# EAGLE board FastDataAcq (EAGLE 6.5.0), part 1 of 3
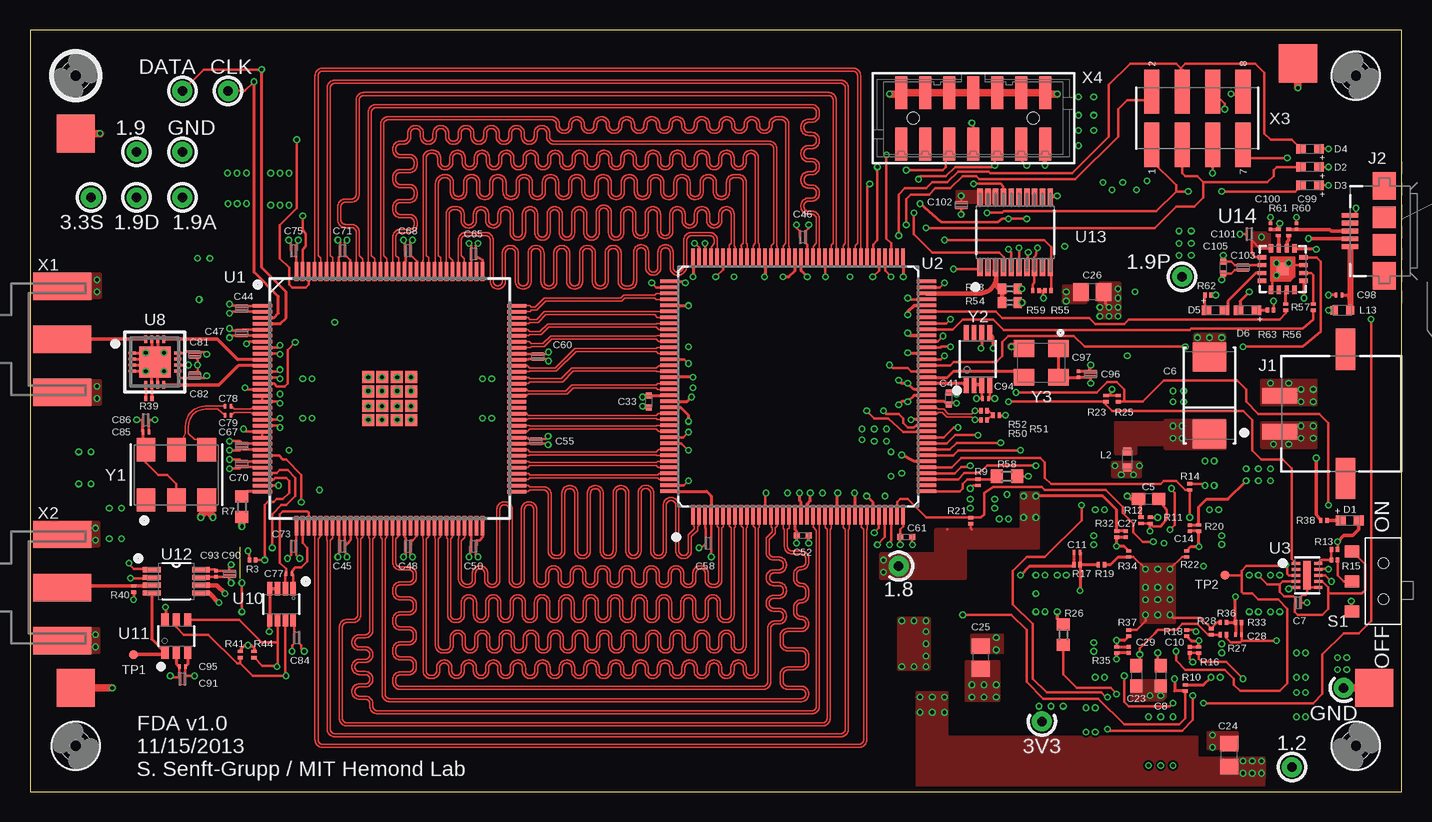
[diagram p3: board, top side]
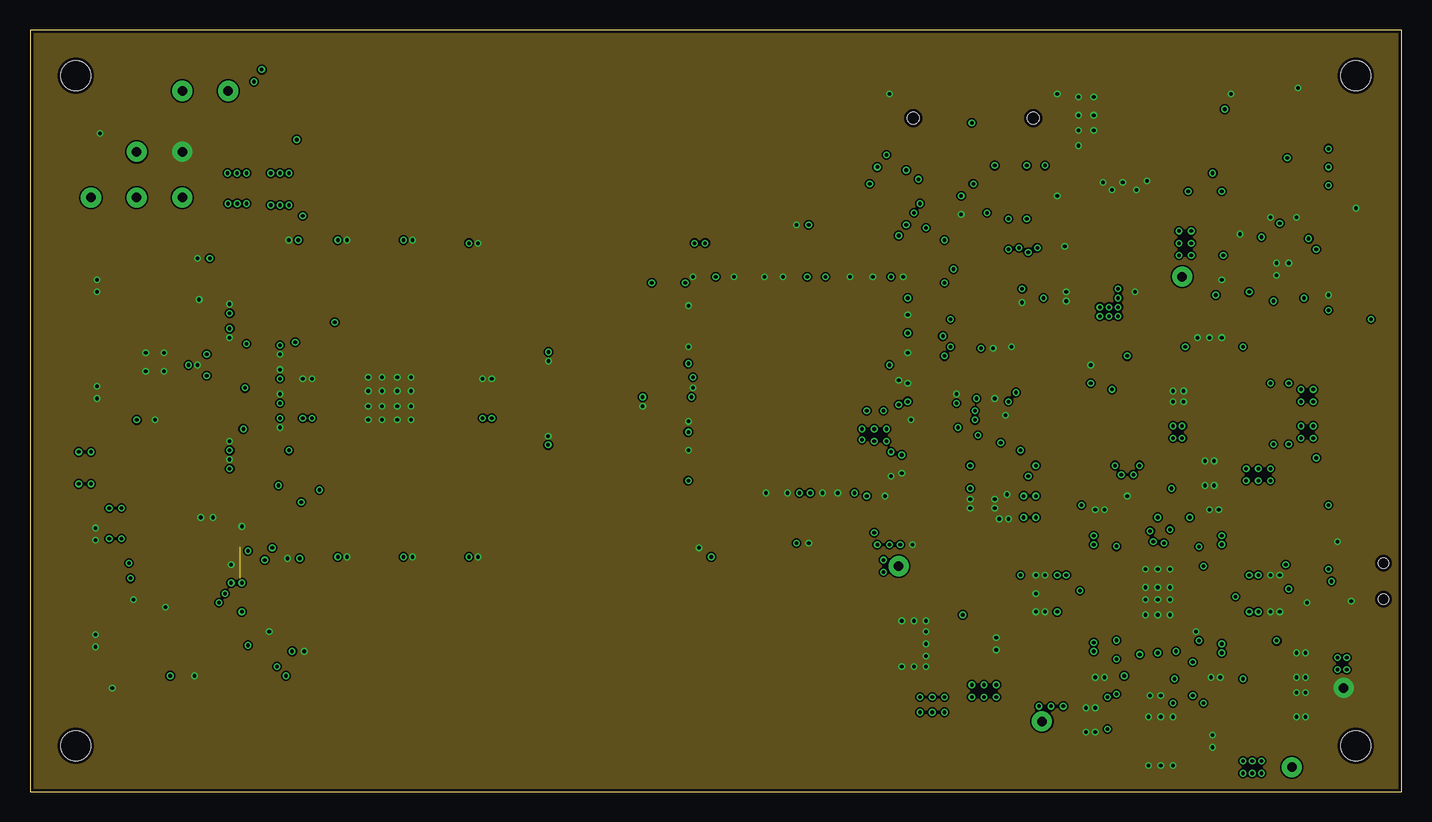
[diagram p4: board, inner layer GND]
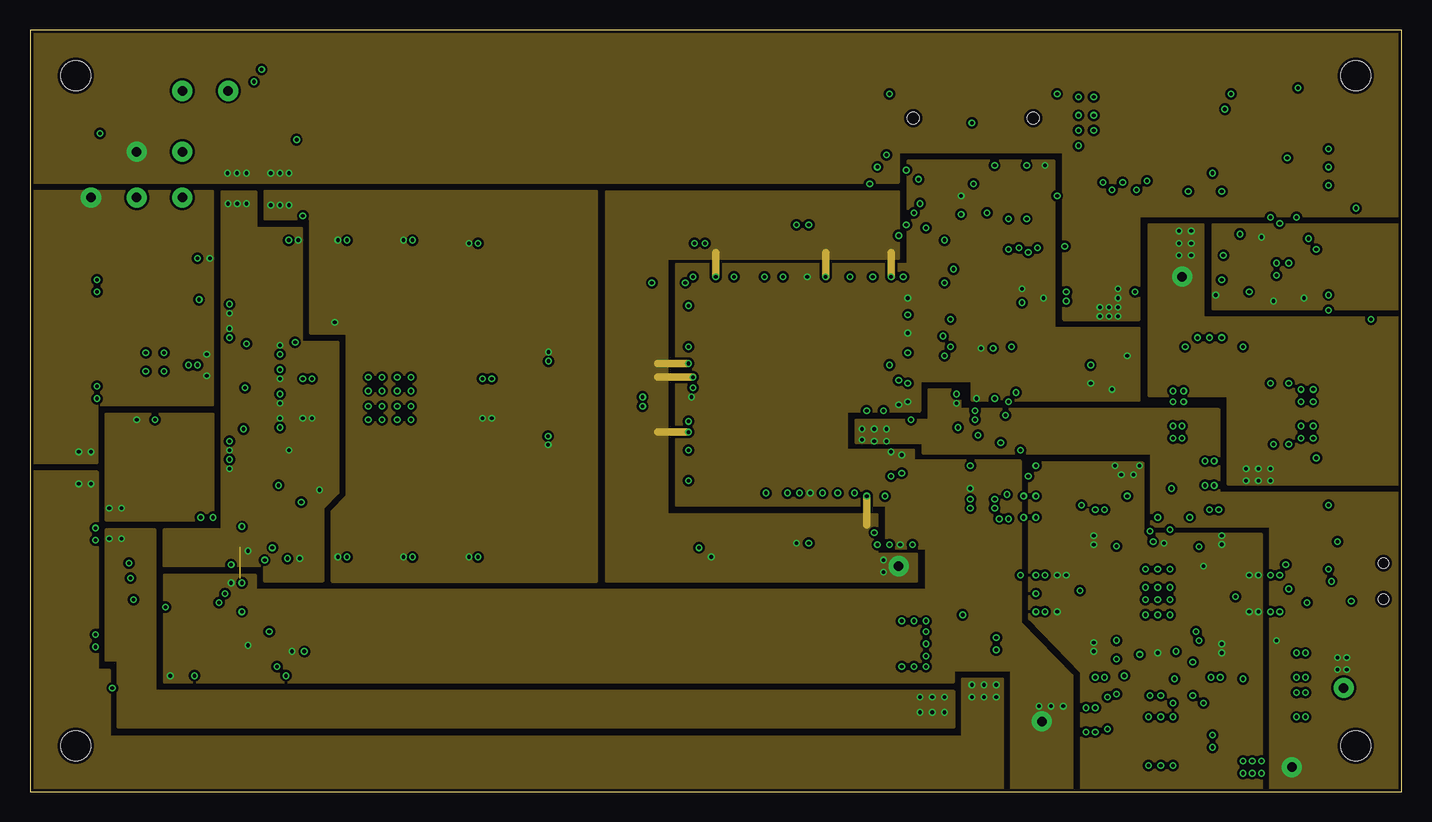
[diagram p5: board, inner layer Power]
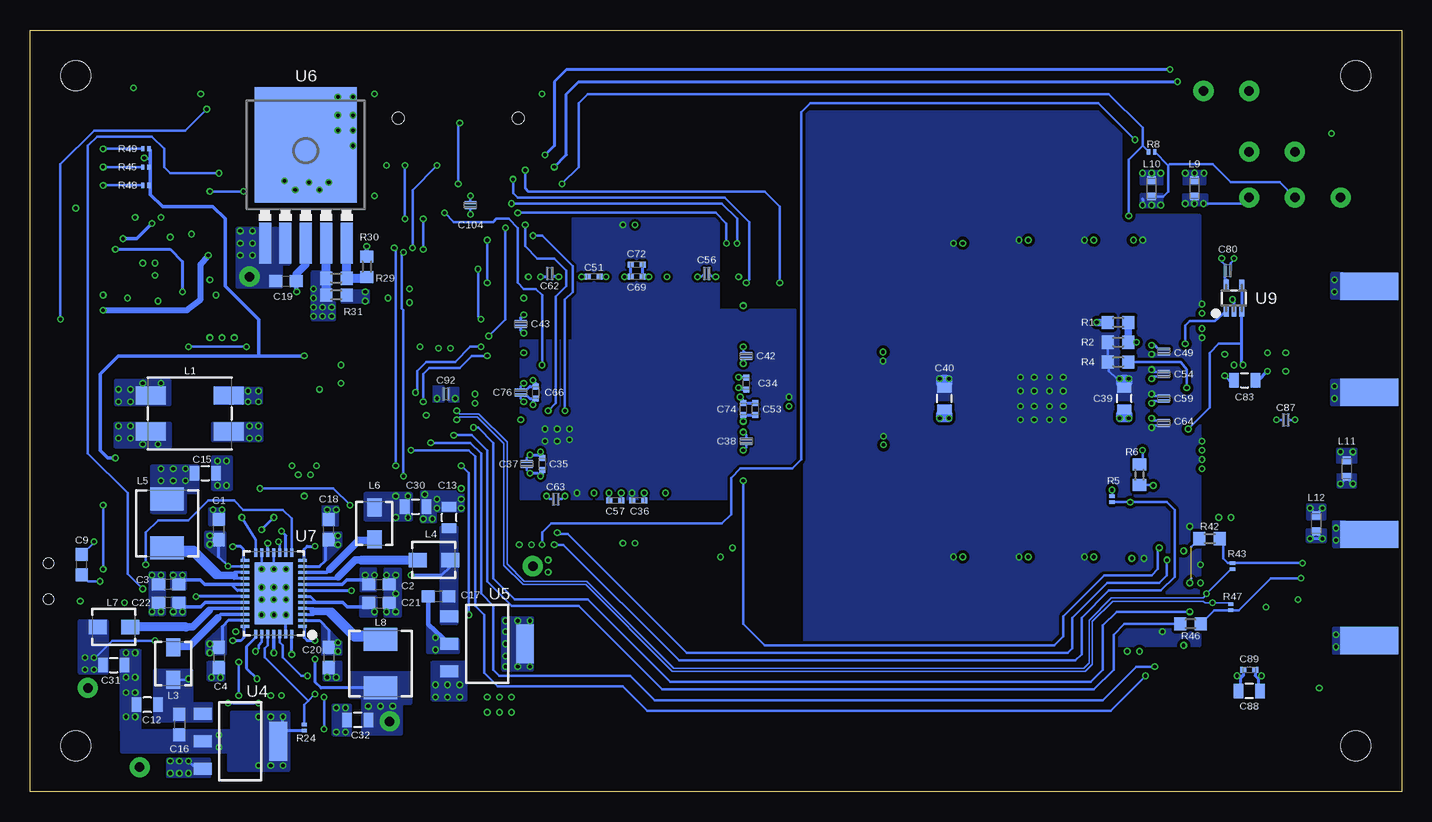
[diagram p6: board, bottom side, seen from below]

Size 114.3 x 63.5 mm. Coordinates in mm from the lower left corner, seen from the top.
Outline: 0,0 114.3,0 114.3,63.5 0,63.5 0,0
Copper layers (1+2*3+16): Top 0.035mm / dielectric 10mil / GND 0.035mm / dielectric 0.15mm / Power 0.035mm / dielectric 0.2mm / Bottom 0.035mm
Design rules "fda_design_rules *": minimum track width 5mil, minimum drill 12mil, track to track 5mil, track to pad 6mil, pad to pad 6mil, via to via 6mil, smd to smd 0mil, copper to edge 10mil, drill to drill 15mil, minimum pad ring 10mil, minimum via ring 5mil, stop-mask expansion 4mil, vias tented up to drill 0mil, thermal gap 10mil
Net classes: 1 50_Ohm: width 0.279 mm, clearance 0.127 mm; 2 Power: clearance 0.152 mm; 3 LVDS_5: width 0.127 mm, clearance 0.127 mm

## Footprints (pad centres in the part's own frame; a part is rotated, then mirrored left to right if it is on the bottom)
C0603 = smd 1.1 x 1: 1 -0.85,0; 2 0.85,0
2917_MURATA_CAP = smd 2.4 x 2.8: P$1 3.2,0; P$2 -3.2,0
0204REVERSE = smd 0.2 x 1: P$1 -0.2,0; P$2 0.2,0
C0201 = smd 0.25 x 0.35: 1 -0.25,0; 2 0.25,0
0805 = smd 0.8 x 1.2: 1 -0.9,0; 2 0.9,0
C0805 = smd 1.3 x 1.5: 1 -0.95,0; 2 0.95,0
0402_C = smd 0.5 x 0.5: P$1 0.5,0; P$2 -0.5,0
0603_LED = smd 0.8 x 0.8: ANODE 0.75,0; CATHODE -0.75,0
2.0 = hole 2.5: 0,0
MICRO-FIT_3.02POS_RA_SMD = smd 1.27 x 2.92: P$1 1.5,4.305; P$2 -1.5,4.305 | smd 3.43 x 1.65: P$3 5.385,-1.165; P$4 -5.385,-1.165
USB_MICROAB_SMT_1 = smd 0.4 x 1.4: D+ 0,4.3; D- -0.65,4.3; GND 1.3,4.3; ID 0.65,4.3; VCC -1.3,4.3 | smd 2.3 x 1.9: P$1 3.75,1.45; P$5 -3.75,1.45 | smd 1.8 x 1.9: P$2 1.15,1.45; P$4 -1.15,1.45
ACM7060_CHOKE = smd 2.5 x 1.5: P$1 -3.25,1.5; P$2 -3.25,-1.5; P$3 3.25,-1.5; P$4 3.25,1.5
MURATA_BLM18 = smd 0.65 x 0.7: P$1 0.675,0; P$2 -0.675,0
3.0X3.6_VISHAY = smd 1.5 x 1.2: P$1 -1.35,0; P$2 1.35,0
5.18X5.49_VISHAY = smd 1.915 x 2.79: P$1 -2.038,0; P$2 2.038,0
SMD1,27-2,54 = smd 3.175 x 3.175: 1 0,0
R0603 = smd 1 x 1.1: 1 -0.85,0; 2 0.85,0
R0201 = smd 0.28 x 0.43: 1 -0.255,0; 2 0.255,0
R0402 = smd 0.7 x 0.9: 1 -0.65,0; 2 0.65,0
AYZ0102AGRLC = smd 0.991 x 1.194: P$1 -2.489,2.616; P$2 0,2.616; P$3 2.489,2.616 | hole 0.864: -1.499,0; 1.499,0
PAD.03X.03 = smd 0.762 x 0.762: P$1 0,0
128HLQFP = smd 0.3 x 1.6: P$1 -7.75,-10.6; P$2 -7.25,-10.6; P$3 -6.75,-10.6; P$4 -6.25,-10.6; P$5 -5.75,-10.6; P$6 -5.25,-10.6; P$7 -4.75,-10.6; P$8 -4.25,-10.6; P$9 -3.75,-10.6; P$10 -3.25,-10.6; P$11 -2.75,-10.6; P$12 -2.25,-10.6; P$13 -1.75,-10.6; P$14 -1.25,-10.6; P$15 -0.75,-10.6; P$16 -0.25,-10.6; P$17 0.25,-10.6; P$18 0.75,-10.6; P$19 1.25,-10.6; P$20 1.75,-10.6; P$21 2.25,-10.6; P$22 2.75,-10.6; P$23 3.25,-10.6; P$24 3.75,-10.6; P$25 4.25,-10.6; P$26 4.75,-10.6; P$27 5.25,-10.6; P$28 5.75,-10.6; P$29 6.25,-10.6; P$30 6.75,-10.6; P$31 7.25,-10.6; P$32 7.75,-10.6; P$65 7.75,10.6; P$66 7.25,10.6; P$67 6.75,10.6; P$68 6.25,10.6; P$69 5.75,10.6; P$70 5.25,10.6; P$71 4.75,10.6; P$72 4.25,10.6; P$73 3.75,10.6; P$74 3.25,10.6; P$75 2.75,10.6; P$76 2.25,10.6; P$77 1.75,10.6; P$78 1.25,10.6; P$79 0.75,10.6; P$80 0.25,10.6; P$81 -0.25,10.6; P$82 -0.75,10.6; P$83 -1.25,10.6; P$84 -1.75,10.6; P$85 -2.25,10.6; P$86 -2.75,10.6; P$87 -3.25,10.6; P$88 -3.75,10.6; P$89 -4.25,10.6; P$90 -4.75,10.6; P$91 -5.25,10.6; P$92 -5.75,10.6; P$93 -6.25,10.6; P$94 -6.75,10.6; P$95 -7.25,10.6; P$96 -7.75,10.6 | smd 1.6 x 0.3: P$33 10.6,-7.75; P$34 10.6,-7.25; P$35 10.6,-6.75; P$36 10.6,-6.25; P$37 10.6,-5.75; P$38 10.6,-5.25; P$39 10.6,-4.75; P$40 10.6,-4.25; P$41 10.6,-3.75; P$42 10.6,-3.25; P$43 10.6,-2.75; P$44 10.6,-2.25; P$45 10.6,-1.75; P$46 10.6,-1.25; P$47 10.6,-0.75; P$48 10.6,-0.25; P$49 10.6,0.25; P$50 10.6,0.75; P$51 10.6,1.25; P$52 10.6,1.75; P$53 10.6,2.25; P$54 10.6,2.75; P$55 10.6,3.25; P$56 10.6,3.75; P$57 10.6,4.25; P$58 10.6,4.75; P$59 10.6,5.25; P$60 10.6,5.75; P$61 10.6,6.25; P$62 10.6,6.75; P$63 10.6,7.25; P$64 10.6,7.75; P$97 -10.6,7.75; P$98 -10.6,7.25; P$99 -10.6,6.75; P$100 -10.6,6.25; P$101 -10.6,5.75; P$102 -10.6,5.25; P$103 -10.6,4.75; P$104 -10.6,4.25; P$105 -10.6,3.75; P$106 -10.6,3.25; P$107 -10.6,2.75; P$108 -10.6,2.25; P$109 -10.6,1.75; P$110 -10.6,1.25; P$111 -10.6,0.75; P$112 -10.6,0.25; P$113 -10.6,-0.25; P$114 -10.6,-0.75; P$115 -10.6,-1.25; P$116 -10.6,-1.75; P$117 -10.6,-2.25; P$118 -10.6,-2.75; P$119 -10.6,-3.25; P$120 -10.6,-3.75; P$121 -10.6,-4.25; P$122 -10.6,-4.75; P$123 -10.6,-5.25; P$124 -10.6,-5.75; P$125 -10.6,-6.25; P$126 -10.6,-6.75; P$127 -10.6,-7.25; P$128 -10.6,-7.75 | smd 1 x 1: P$129 0.6,0.6; P$130 1.8,0.6; P$131 -0.6,0.6; P$132 -1.8,0.6; P$133 0.6,1.8; P$134 1.8,1.8; P$135 -0.6,1.8; P$136 -1.8,1.8; P$137 0.6,-1.8; P$138 1.8,-1.8; P$139 -0.6,-1.8; P$140 -1.8,-1.8; P$141 0.6,-0.6; P$142 1.8,-0.6; P$143 -0.6,-0.6; P$144 -1.8,-0.6
TQG144 = smd 0.3 x 1.6: P$1 -8.75,-10.7; P$2 -8.25,-10.7; P$3 -7.75,-10.7; P$4 -7.25,-10.7; P$5 -6.75,-10.7; P$6 -6.25,-10.7; P$7 -5.75,-10.7; P$8 -5.25,-10.7; P$9 -4.75,-10.7; P$10 -4.25,-10.7; P$11 -3.75,-10.7; P$12 -3.25,-10.7; P$13 -2.75,-10.7; P$14 -2.25,-10.7; P$15 -1.75,-10.7; P$16 -1.25,-10.7; P$17 -0.75,-10.7; P$18 -0.25,-10.7; P$19 0.25,-10.7; P$20 0.75,-10.7; P$21 1.25,-10.7; P$22 1.75,-10.7; P$23 2.25,-10.7; P$24 2.75,-10.7; P$25 3.25,-10.7; P$26 3.75,-10.7; P$27 4.25,-10.7; P$28 4.75,-10.7; P$29 5.25,-10.7; P$30 5.75,-10.7; P$31 6.25,-10.7; P$32 6.75,-10.7; P$33 7.25,-10.7; P$34 7.75,-10.7; P$35 8.25,-10.7; P$36 8.75,-10.7; P$73 8.75,10.7; P$74 8.25,10.7; P$75 7.75,10.7; P$76 7.25,10.7; P$77 6.75,10.7; P$78 6.25,10.7; P$79 5.75,10.7; P$80 5.25,10.7; P$81 4.75,10.7; P$82 4.25,10.7; P$83 3.75,10.7; P$84 3.25,10.7; P$85 2.75,10.7; P$86 2.25,10.7; P$87 1.75,10.7; P$88 1.25,10.7; P$89 0.75,10.7; P$90 0.25,10.7; P$91 -0.25,10.7; P$92 -0.75,10.7; P$93 -1.25,10.7; P$94 -1.75,10.7; P$95 -2.25,10.7; P$96 -2.75,10.7; P$97 -3.25,10.7; P$98 -3.75,10.7; P$99 -4.25,10.7; P$100 -4.75,10.7; P$101 -5.25,10.7; P$102 -5.75,10.7; P$103 -6.25,10.7; P$104 -6.75,10.7; P$105 -7.25,10.7; P$106 -7.75,10.7; P$107 -8.25,10.7; P$108 -8.75,10.7 | smd 1.6 x 0.3: P$37 10.7,-8.75; P$38 10.7,-8.25; P$39 10.7,-7.75; P$40 10.7,-7.25; P$41 10.7,-6.75; P$42 10.7,-6.25; P$43 10.7,-5.75; P$44 10.7,-5.25; P$45 10.7,-4.75; P$46 10.7,-4.25; P$47 10.7,-3.75; P$48 10.7,-3.25; P$49 10.7,-2.75; P$50 10.7,-2.25; P$51 10.7,-1.75; P$52 10.7,-1.25; P$53 10.7,-0.75; P$54 10.7,-0.25; P$55 10.7,0.25; P$56 10.7,0.75; P$57 10.7,1.25; P$58 10.7,1.75; P$59 10.7,2.25; P$60 10.7,2.75; P$61 10.7,3.25; P$62 10.7,3.75; P$63 10.7,4.25; P$64 10.7,4.75; P$65 10.7,5.25; P$66 10.7,5.75; P$67 10.7,6.25; P$68 10.7,6.75; P$69 10.7,7.25; P$70 10.7,7.75; P$71 10.7,8.25; P$72 10.7,8.75; P$109 -10.7,8.75; P$110 -10.7,8.25; P$111 -10.7,7.75; P$112 -10.7,7.25; P$113 -10.7,6.75; P$114 -10.7,6.25; P$115 -10.7,5.75; P$116 -10.7,5.25; P$117 -10.7,4.75; P$118 -10.7,4.25; P$119 -10.7,3.75; P$120 -10.7,3.25; P$121 -10.7,2.75; P$122 -10.7,2.25; P$123 -10.7,1.75; P$124 -10.7,1.25; P$125 -10.7,0.75; P$126 -10.7,0.25; P$127 -10.7,-0.25; P$128 -10.7,-0.75; P$129 -10.7,-1.25; P$130 -10.7,-1.75; P$131 -10.7,-2.25; P$132 -10.7,-2.75; P$133 -10.7,-3.25; P$134 -10.7,-3.75; P$135 -10.7,-4.25; P$136 -10.7,-4.75; P$137 -10.7,-5.25; P$138 -10.7,-5.75; P$139 -10.7,-6.25; P$140 -10.7,-6.75; P$141 -10.7,-7.25; P$142 -10.7,-7.75; P$143 -10.7,-8.25; P$144 -10.7,-8.75
10-DFN = smd 0.25 x 0.7: P$1 -1,-0.925; P$2 -0.5,-0.925; P$3 0,-0.925; P$4 0.5,-0.925; P$5 1,-0.925; P$6 1,0.925; P$7 0.5,0.925; P$8 0,0.925; P$9 -0.5,0.925; P$10 -1,0.925 | smd 2.39 x 0.64: P$11 0,0
SOT223 = smd 0.991 x 1.499: 1 -2.299,-3.15; 2 0,-3.15; 3 2.299,-3.15 | smd 3.277 x 1.499: 4 0,3.15
Q5-DD = smd 1 x 3.4: 1 -3.4,-7.875; 2 -1.7,-7.875; 3 0,-7.875; 4 1.7,-7.875; 5 3.4,-7.875 | smd 8.5 x 9.6: 6 0,0.325
38-QFN_(5X7) = smd 0.25 x 0.7: P$1 -2.75,-2.4; P$2 -2.25,-2.4; P$3 -1.75,-2.4; P$4 -1.25,-2.4; P$5 -0.75,-2.4; P$6 -0.25,-2.4; P$7 0.25,-2.4; P$8 0.75,-2.4; P$9 1.25,-2.4; P$10 1.75,-2.4; P$11 2.25,-2.4; P$12 2.75,-2.4; P$20 2.75,2.4; P$21 2.25,2.4; P$22 1.75,2.4; P$23 1.25,2.4; P$24 0.75,2.4; P$25 0.25,2.4; P$26 -0.25,2.4; P$27 -0.75,2.4; P$28 -1.25,2.4; P$29 -1.75,2.4; P$30 -2.25,2.4; P$31 -2.75,2.4 | smd 0.7 x 0.25: P$13 3.4,-1.5; P$14 3.4,-1; P$15 3.4,-0.5; P$16 3.4,0; P$17 3.4,0.5; P$18 3.4,1; P$19 3.4,1.5; P$32 -3.4,1.5; P$33 -3.4,1; P$34 -3.4,0.5; P$35 -3.4,0; P$36 -3.4,-0.5; P$37 -3.4,-1; P$38 -3.4,-1.5 | smd 5.15 x 3.15: P$39 0,0
16WQFN = smd 0.25 x 0.6: P$1 0.75,1.9; P$2 0.25,1.9; P$3 -0.25,1.9; P$4 -0.75,1.9; P$9 -0.75,-1.9; P$10 -0.25,-1.9; P$11 0.25,-1.9; P$12 0.75,-1.9 | smd 0.6 x 0.25: P$5 -1.9,0.75; P$6 -1.9,0.25; P$7 -1.9,-0.25; P$8 -1.9,-0.75; P$13 1.9,-0.75; P$14 1.9,-0.25; P$15 1.9,0.25; P$16 1.9,0.75 | smd 2.6 x 2.6: P$17 0,0
SC-70 = smd 0.4 x 0.9: P$1 -0.65,-1.1; P$2 0,-1.1; P$3 0.65,-1.1; P$4 0.65,1.1; P$5 -0.65,1.1
SOT23-8 = smd 0.45 x 1.1: P$1 -0.975,-1.3; P$2 -0.325,-1.3; P$3 0.325,-1.3; P$4 0.975,-1.3; P$5 0.975,1.3; P$6 0.325,1.3; P$7 -0.325,1.3; P$8 -0.975,1.3
SOT23-6 = smd 0.6 x 1.1: P$1 -0.95,-1.35; P$2 0,-1.35; P$3 0.95,-1.35; P$4 0.95,1.35; P$5 0,1.35; P$6 -0.95,1.35
SOP65P490X110-8N = smd 1.499 x 0.432: 1 -2.057,0.975; 2 -2.057,0.325; 3 -2.057,-0.325; 4 -2.057,-0.975; 5 2.057,-0.975; 6 2.057,-0.325; 7 2.057,0.325; 8 2.057,0.975
TSSOP20_XILINX = smd 1.5 x 0.45: P$1 -2.9,2.925; P$2 -2.9,2.275; P$3 -2.9,1.625; P$4 -2.9,0.975; P$5 -2.9,0.325; P$6 -2.9,-0.325; P$7 -2.9,-0.975; P$8 -2.9,-1.625; P$9 -2.9,-2.275; P$10 -2.9,-2.925; P$11 2.9,-2.925; P$12 2.9,-2.275; P$13 2.9,-1.625; P$14 2.9,-0.975; P$15 2.9,-0.325; P$16 2.9,0.325; P$17 2.9,0.975; P$18 2.9,1.625; P$19 2.9,2.275; P$20 2.9,2.925
QFN16 = smd 0.7 x 0.35: 1 -1.725,0.975; 2 -1.725,0.325; 3 -1.725,-0.325; 4 -1.725,-0.975; 9 1.725,-0.975; 10 1.725,-0.325; 11 1.725,0.325; 12 1.725,0.975 | smd 0.35 x 0.7: 5 -0.975,-1.725; 6 -0.325,-1.725; 7 0.325,-1.725; 8 0.975,-1.725; 13 0.975,1.725; 14 0.325,1.725; 15 -0.325,1.725; 16 -0.975,1.725 | smd 1 x 1: TAB 0,0
J502-ND-142-0701-801/806 = smd 4.826 x 2.286: 1 2.692,0; G@1 2.692,4.42; G@2 2.692,-4.42 | smd 4.826 x 2.286 bottom: G@3 2.692,4.42; G@4 2.692,-4.42
HEADER_8P_2R_SMT = smd 1.27 x 3.683: P$1 -3.81,-2.223; P$2 -3.81,2.223; P$3 -1.27,-2.223; P$4 -1.27,2.223; P$5 1.27,-2.223; P$6 1.27,2.223; P$7 3.81,-2.223; P$8 3.81,2.223
87832-14 = smd 1 x 2.75: 1 -6,-2.15; 2 -6,2.15; 3 -4,-2.15; 4 -4,2.15; 5 -2,-2.15; 6 -2,2.15; 7 0,-2.15; 8 0,2.15; 9 2,-2.15; 10 2,2.15; 11 4,-2.15; 12 4,2.15; 13 6,-2.15; 14 6,2.15 | hole 1: -5,0; 5,0
SI530 = smd 1.95 x 1.55: P$1 -2.1,2.54; P$2 -2.1,0; P$3 -2.1,-2.54; P$4 2.1,-2.54; P$5 2.1,0; P$6 2.1,2.54
UMAX8 = smd 1.35 x 0.4: P$1 -2.15,0.975; P$2 -2.15,0.325; P$3 -2.15,-0.325; P$4 -2.15,-0.975; P$5 2.15,-0.975; P$6 2.15,-0.325; P$7 2.15,0.325; P$8 2.15,0.975
SI500S = smd 1.7 x 1.4: P$1 -1.45,-1.2; P$2 1.45,-1.2; P$3 1.45,1.2; P$4 -1.45,1.2

## Placement (x,y rotation side)
C1  10uF  [C0603]  98.55,21.84 90 bottom
C2  10uF  [C0603]  85.22,17.27 0 bottom
C3  10uF  [C0603]  102.74,17.27 180 bottom
C4  10uF  [C0603]  98.55,11.18 270 bottom
C5  DNP  [C0603]  93.22,24.38 180 top
C6  100uF  [2917_MURATA_CAP]  98.3,33.02 270 top
C7  .1uF  [0204REVERSE]  105.66,15.75 0 top
C8  10uF  [C0603]  94.23,9.65 270 top
C9  DNP  [C0603]  109.98,18.92 90 bottom
C10  10pF  [C0201]  96.65,11.81 90 top
C11  10pF  [C0201]  87.25,19.94 0 top
C12  33uF  [0805]  104.52,7.24 180 bottom
C13  33uF  [0805]  79.38,22.86 90 bottom
C14  10pF  [C0201]  96.65,21.97 270 top
C15  33uF  [0805]  99.69,26.54 0 bottom
C16  10uF  [C0603]  101.85,5.59 270 bottom
C17  10uF  [C0603]  80.26,16.26 180 bottom
C18  10uF  [C0603]  89.41,21.84 90 bottom
C19  10uF  [C0603]  92.96,42.55 0 bottom
C20  10uF  [C0603]  89.41,11.18 270 bottom
C21  10uF  [C0603]  85.22,15.75 0 bottom
C22  10uF  [C0603]  102.74,15.75 180 bottom
C23  DNP  [C0603]  92.2,9.65 270 top
C24  22uF 150mOhm ESR  [C0805]  99.95,3.05 90 top
C25  22uF 150mOhm ESR  [C0805]  79.25,11.18 90 top
C26  22uF 150mOhm ESR  [C0805]  88.52,41.66 180 top
C27  10pF  [C0201]  91.31,21.46 270 top
C28  10pF  [C0201]  100.71,13.08 180 top
C29  10pF  [C0201]  91.57,11.81 90 top
C30  33uF  [0805]  82.17,23.75 0 bottom
C31  33uF  [0805]  107.31,10.54 0 bottom
C32  33uF  [0805]  87,5.97 180 bottom
C33  4.7uF  [0402_C]  51.56,32.51 90 top
C34  4.7uF  [0402_C]  54.61,34.04 90 bottom
C35  4.7uF  [0402_C]  71.63,27.3 90 bottom
C36  4.7uF  [0402_C]  63.63,24.26 180 bottom
C37  0.47uF  [0204REVERSE]  72.9,27.3 270 bottom
C38  0.47uF  [0204REVERSE]  54.61,29.21 270 bottom
C39  33uF  [0805]  23.11,32.77 90 bottom
C40  33uF  [0805]  38.1,32.77 90 bottom
C41  4.7uF  [0402_C]  76.58,32.77 270 top
C42  0.47uF  [0204REVERSE]  54.61,36.32 90 bottom
C43  0.47uF  [0204REVERSE]  73.41,38.99 90 bottom
C44  .1uF  [0204REVERSE]  17.65,40.26 90 top
C45  .1uF  [0204REVERSE]  26.04,20.45 0 top
C46  0.47uF  [0204REVERSE]  64.39,46.23 180 top
C47  .1uF  [0204REVERSE]  17.65,38.23 90 top
C48  .1uF  [0204REVERSE]  31.5,20.45 0 top
C49  .1uF  [0204REVERSE]  19.81,36.7 90 bottom
C50  .1uF  [0204REVERSE]  36.96,20.45 0 top
C51  4.7uF  [0402_C]  67.31,42.93 0 bottom
C52  4.7uF  [0402_C]  64.39,21.34 180 top
C53  4.7uF  [0402_C]  53.85,31.88 90 bottom
C54  .1uF  [0204REVERSE]  19.81,34.8 90 bottom
C55  .1uF  [0204REVERSE]  42.16,29.21 90 top
C56  0.47uF  [0204REVERSE]  57.91,43.18 180 bottom
C57  4.7uF  [0402_C]  65.53,24.26 0 bottom
C58  0.47uF  [0204REVERSE]  56.52,20.7 180 top
C59  .1uF  [0204REVERSE]  19.81,32.77 90 bottom
C60  .1uF  [0204REVERSE]  42.32,36.27 270 top
C61  4.7uF  [0402_C]  73.03,21.21 180 top
C62  0.47uF  [0204REVERSE]  70.99,43.18 0 bottom
C63  0.47uF  [0204REVERSE]  70.48,24.38 180 bottom
C64  .1uF  [0204REVERSE]  19.81,30.73 90 bottom
C65  .1uF  [0204REVERSE]  36.96,44.83 0 top
C66  4.7uF  [0402_C]  72.14,33.27 270 bottom
C67  .1uF  [0204REVERSE]  17.65,28.83 90 top
C68  .1uF  [0204REVERSE]  31.5,45.09 0 top
C69  4.7uF  [0402_C]  63.75,42.93 180 bottom
C70  .1uF  [0204REVERSE]  17.65,27.3 90 top
C71  .1uF  [0204REVERSE]  26.04,45.09 0 top
C72  4.7uF  [0402_C]  63.75,43.94 180 bottom
C73  .1uF  [0204REVERSE]  21.97,20.45 0 top
C74  4.7uF  [0402_C]  54.86,31.88 90 bottom
C75  .1uF  [0204REVERSE]  21.97,45.09 180 top
C76  0.47uF  [0204REVERSE]  73.41,33.27 90 bottom
C77  100pF  [C0201]  21.59,18.16 180 top
C78  4.7nF  [C0201]  16.51,32.13 0 top
C79  4.7nF  [C0201]  16.51,31.37 0 top
C80  .1uF  [0204REVERSE]  14.48,43.43 0 bottom
C81  .1uF  [0204REVERSE]  13.72,36.45 270 top
C82  .1uF  [0204REVERSE]  13.72,34.67 90 top
C83  33uF  [0805]  13.08,34.29 0 bottom
C84  .1uF  [0204REVERSE]  22.23,12.83 0 top
C85  10nF  [C0201]  9.65,29.97 0 top
C86  .1uF  [0204REVERSE]  9.65,30.99 0 top
C87  1uF  [0204REVERSE]  9.65,30.99 180 bottom
C88  33uF  [0805]  12.7,8.38 180 bottom
C89  4.7uF  [0402_C]  12.7,10.16 0 bottom
C90  1uF  [0204REVERSE]  16.64,18.16 90 top
C91  .1uF  [0204REVERSE]  12.7,9.4 0 top
C92  .1uF  [0204REVERSE]  79.63,33.15 180 bottom
C93  10nF  [C0201]  15.49,18.16 90 top
C94  10nF  [C0201]  79.63,32.77 0 top
C95  10nF  [C0201]  12.7,10.41 0 top
C96  .1uF  [0204REVERSE]  88.39,34.8 90 top
C97  10nF  [C0201]  87.38,34.8 90 top
C98  10nF  [C0201]  109.09,41.4 180 top
C99  47pF  [C0201]  105.54,47.12 270 top
C100  47pF  [C0201]  103.38,47.12 270 top
C101  .1uF  [0204REVERSE]  101.6,46.48 0 top
C102  .1uF  [0204REVERSE]  77.6,48.9 270 top
C103  .1uF  [0204REVERSE]  101.09,43.69 90 top
C104  1uF  [0204REVERSE]  77.6,48.9 270 bottom
C105  4.7uF  [0402_C]  99.44,43.69 270 top
D1  LED_0603_RED  [0603_LED]  109.98,22.61 180 top
D2  LED_0603_BLUE  [0603_LED]  106.68,52.07 0 top
D3  LED_0603_GREEN  [0603_LED]  106.68,50.55 0 top
D4  LED_0603_RED  [0603_LED]  106.68,53.59 0 top
D5  LED_0603_GREEN  [0603_LED]  98.81,40.13 180 top
D6  LED_0603_BLUE  [0603_LED]  101.47,40.13 0 top
H1  MOUNT-HOLE2.0  [2.0]  110.49,3.81 0 top
H2  MOUNT-HOLE2.0  [2.0]  110.49,59.69 90 top
H3  MOUNT-HOLE2.0  [2.0]  3.81,3.81 90 top
H4  MOUNT-HOLE2.0  [2.0]  3.81,59.69 0 top
J1  MICRO-FIT_3.0_2POS_RA_SMD  [MICRO-FIT_3.02POS_RA_SMD]  108.46,31.5 90 top
J2  USB_MICROAB_SMT  [USB_MICROAB_SMT_1]  114.3,46.74 90 top
L1  CHOKE_CM_ACM7060-301  [ACM7060_CHOKE]  100.97,31.53 0 bottom
L2  26  [MURATA_BLM18]  91.44,27.69 90 top
L3  2.2uH  [3.0X3.6_VISHAY]  102.36,10.67 270 bottom
L4  2.2uH  [3.0X3.6_VISHAY]  80.64,19.3 0 bottom
L5  2.2uH  [5.18X5.49_VISHAY]  102.87,22.35 90 bottom
L6  2.2uH  [3.0X3.6_VISHAY]  85.6,22.35 90 bottom
L7  2.2uH  [3.0X3.6_VISHAY]  107.31,13.72 180 bottom
L8  2.2uH  [5.18X5.49_VISHAY]  85.09,10.67 270 bottom
L9  26  [MURATA_BLM18]  17.27,50.29 90 bottom
L10  26  [MURATA_BLM18]  20.83,50.29 90 bottom
L11  26  [MURATA_BLM18]  4.57,26.92 90 bottom
L12  26  [MURATA_BLM18]  7.11,22.35 90 bottom
L13  330  [MURATA_BLM18]  109.35,40.13 0 top
PAD1  [SMD1,27-2,54]  3.81,8.64 90 top
PAD2  [SMD1,27-2,54]  112.01,8.64 0 top
PAD3  [SMD1,27-2,54]  3.81,54.86 0 top
PAD4  [SMD1,27-2,54]  105.66,60.71 0 top
R1  DNP  [R0603]  23.62,39.12 180 bottom
R2  DNP  [R0603]  23.62,37.47 0 bottom
R3  10k  [R0201]  18.54,19.3 0 top
R4  DNP  [R0603]  23.62,35.81 0 bottom
R5  10k  [R0201]  24.13,24.38 270 bottom
R6  DNP  [R0603]  21.84,26.42 90 bottom
R7  3.3k 0.1%  [R0603]  17.65,23.75 90 top
R8  10k  [R0201]  20.83,53.34 0 bottom
R9  4.7k  [R0201]  78.99,25.78 270 top
R10  523K  [R0201]  96.27,8.64 270 top
R11  649K  [R0201]  93.34,22.61 270 top
R12  150K  [R0201]  92.58,22.61 90 top
R13  523K  [R0201]  108.71,19.3 0 top
R14  523K  [R0201]  96.65,25.4 270 top
R15  113k  [R0201]  108.71,20.19 180 top
R16  523K  [R0201]  97.41,11.81 270 top
R17  523K  [R0201]  87.25,18.92 180 top
R18  210K  [R0201]  96.39,13.21 270 top
R19  150K  [R0201]  89.28,18.92 180 top
R20  523K  [R0201]  97.41,21.97 90 top
R21  10k  [R0201]  78.39,22.59 270 top
R22  280K  [R0201]  96.39,19.81 90 top
R23  523K  [R0201]  89.66,32.77 90 top
R24  523K  [R0201]  91.44,5.33 90 bottom
R25  523K  [R0201]  90.68,32.77 90 top
R26  DNP  [R0603]  86.11,13.08 270 top
R27  270k  [R0201]  99.44,13.08 180 top
R28  210K  [R0201]  98.42,13.34 270 top
R29  1.15k 1%  [R0603]  88.77,42.8 180 bottom
R30  2k 1%  [R0603]  86.23,43.76 270 bottom
R31  100  [R0603]  88.77,41.4 180 bottom
R32  806K  [R0201]  90.55,21.46 90 top
R33  210K  [R0201]  100.71,14.1 0 top
R34  649K  [R0201]  91.57,19.81 90 top
R35  845k  [R0201]  90.55,11.81 270 top
R36  422K  [R0201]  99.44,14.1 0 top
R37  270k  [R0201]  91.57,13.21 270 top
R38  330  [R0201]  107.82,22.61 0 top
R39  50  [R0201]  9.91,32.77 180 top
R40  50  [R0201]  8.64,16.89 90 top
R41  10k  [R0201]  17.53,11.43 90 top
R42  26.1k  [R0603]  16,21.08 0 bottom
R43  10k  [R0201]  14.1,18.8 270 bottom
R44  10k  [R0201]  18.67,11.43 90 top
R45  330  [R0201]  104.65,52.07 180 bottom
R46  16k  [R0603]  17.59,13.99 0 bottom
R47  10k  [R0201]  14.22,15.37 90 bottom
R48  330  [R0201]  104.65,50.55 180 bottom
R49  330  [R0201]  104.65,53.59 180 bottom
R50  50  [R0201]  79.5,30.99 180 top
R51  50  [R0201]  80.52,31.37 180 top
R52  50  [R0201]  79.5,31.75 180 top
R53  100 0.1%  [R0402]  81.66,41.91 0 top
R54  100 0.1%  [R0402]  81.66,40.77 180 top
R55  330  [R0201]  84.84,41.78 180 top
R56  330  [R0201]  104.65,40.39 270 top
R57  330  [R0201]  106.93,40.39 270 top
R58  0  [R0603]  81.41,26.29 180 top
R59  4.7k  [R0201]  83.82,41.78 0 top
R60  27  [R0201]  104.9,46.61 270 top
R61  27  [R0201]  104.01,46.61 270 top
R62  330  [R0201]  98.17,41.4 180 top
R63  330  [R0201]  103.38,40.13 180 top
S1  SLIDER_SPDT_AYZ0102AGRLC  [AYZ0102AGRLC]  112.78,17.53 90 top
TP1  TEST-POINT3  [PAD.03X.03]  8.64,11.43 0 top
TP2  TEST-POINT3  [PAD.03X.03]  99.57,18.03 0 top
U1  ADC08D500  [128HLQFP]  29.97,32.77 270 top
U2  XC6SLX9-3TQG144C  [TQG144]  64.01,33.78 0 top
U3  LTC2955-1  [10-DFN]  106.43,18.03 270 top
U4  LT1963AEST-2.5  [SOT223]  96.77,4.19 270 bottom
U5  LT1963AEST-3.3  [SOT223]  76.2,12.32 270 bottom
U6  LT1963AEQ  [Q5-DD]  91.31,53.59 0 bottom
U7  LTC3374QFN  [38-QFN_(5X7)]  93.98,16.51 90 bottom
U8  LMH6555  [16WQFN]  10.41,35.81 90 top
U9  LMV321SC-70  [SC-70]  13.97,41.15 0 bottom
U10  TMP421  [SOT23-8]  20.95,15.62 180 top
U11  DAC101C081  [SOT23-6]  12.19,12.95 0 top
U12  ADCMP553BRMZ  [SOP65P490X110-8N]  12.19,17.53 0 top
U13  XCFXXS04  [TSSOP20_XILINX]  82.1,46.63 90 top
U14  FT230XQ  [QFN16]  104.39,43.56 180 top
X1  SMA-142-0701-801/806  [J502-ND-142-0701-801/806]  0,37.72 0 top
X2  SMA-142-0701-801/806  [J502-ND-142-0701-801/806]  0,17.02 0 top
X3  HEADER_0.1"_8P_2R_SMT  [HEADER_8P_2R_SMT]  97.28,56.13 0 top
X4  87832-14  [87832-14]  78.61,56.13 180 top
Y1  SI530-500  [SI530]  12.19,26.42 90 top
Y2  100MHz  [UMAX8]  78.99,36.07 90 top
Y3  DNP  [SI500S]  84.27,35.74 180 top

## Tracks (layer width: path | path; a pad name or v marks a point on that pad's centre or on a via)
1V2  (via drill 0.3, 0.79 pad 1.68)
  Top 0.203: R27.1 99.7,12.83 100.08,12.45 100.84,12.45 100.97,12.57 | 100.97,12.57 C28.1 | v64.9,47.24 64.9,46.99 64.64,46.74 64.64,46.28 C46.P$1 64.64,46.17 64.64,45.72 64.76,45.6 U2.P$89 | v103.89,12.57 100.97,12.57
  Top 0.254: C28.1 R33.2 | U2.P$128 53.29,33.01 C33.P$1 51.44,32.89 v51.05,32.89 | U2.P$19 64.26,24.13 C36.P$1 64.13,24.88 v64.14,24.89 | U2.P$28 68.76,24.84 v68.71,24.89 | v77.22,32.38 76.7,32.38 C41.P$1 76.45,32.27 76.2,32.51 74.73,32.51 U2.P$52
  Bottom 0.203: v108.97,11.18 108.84,11.18 107.44,12.57 v103.89,12.57
  other vias: 109.73,11.18 108.97,10.16 109.73,10.16 71.37,29.21 71.37,30.23 69.34,30.23 69.34,29.34 70.36,30.23 70.36,29.21 105.16,2.03
  pour Bottom (isolate 0.203, no thermals): 56.9,47.75 56.9,40.13 50.55,40.13 50.55,24.38 73.41,24.38 73.41,37.59 69.09,37.59 69.09,47.75
  pour Bottom (no thermals): 107.82,9.91 107.82,14.22 110.24,14.22 110.24,9.91
  pour Power (isolate 0.203, no thermals): 114.05,0.25 103.38,0.25 103.38,22.1 93.47,22.1 93.47,28.19 74.42,28.19 74.42,29.08 68.83,29.08 68.83,30.99 74.93,30.99 74.93,33.53 77.47,33.53 77.47,31.88 99.06,31.88 99.06,24.89 114.05,24.89
1V8  (via drill 0.3, 0.79 pad 1.68)
  Top 0.203: U2.P$76 71.26,43.42 v71.75,42.93 | U2.P$103 57.76,43.53 v57.15,42.93 | U2.P$122 54.52,36.03 v54.86,35.69 | U2.P$135 54.42,29.53 v54.86,29.97 | U2.P$86 66.26,42.96 v66.29,42.93 | v56.77,19.56 56.77,20.65 C58.P$1 56.76,20.74 56.76,22.35 U2.P$4 | 76.44,21.86 76.45,21.84 | R21.2 78.39,21.94 78.49,21.84
  Top 0.254: C27.1 R32.2 90.55,23.5 89.41,24.64 v83.82,24.64 | v55.24,34.54 53.32,34.54 U2.P$125 | U2.P$31 70.26,24.1 v69.72,24.64 | U2.P$18 63.75,21.84 63.89,21.71 C52.P$1 63.88,21.33 v63.88,20.7 | U2.P$144 56.38,25.03 56.77,24.64 56.77,22.36 56.76,22.35
  Power 0.635: v57.15,42.93 57.15,44.96 | v71.75,42.93 71.75,44.96 | v69.72,24.64 69.72,22.23 | v54.86,29.97 52.32,29.97 | v55.24,34.54 52.32,34.54 | v54.86,35.69 52.32,35.69 | v66.29,42.93 66.29,44.96
  Bottom 0.203: 71.25,42.93 71.19,42.98 C62.P$1 | v57.15,42.93 57.46,42.93 C56.P$1 | v54.86,35.69 54.86,35.87 C42.P$1 | C38.P$1 54.61,29.72 v54.86,29.97 | C51.P$1 v66.29,42.93 | C63.P$1 69.98,24.38 v69.72,24.64
  Bottom 0.254: v71.75,42.93 71.25,42.93 | C34.P$1 v55.24,34.54
  other vias: 82.8,24.64 82.8,22.86 83.82,22.86 71.12,19.3 71.12,18.29 72.39,18.8
  pour Power (isolate 0.203, no thermals): 72.39,44.45 72.39,50.04 48.01,50.04 48.01,17.53 73.91,17.53 73.91,19.81 70.61,19.81 70.61,23.11 53.09,23.11 53.09,44.45
  pour Bottom (no thermals): 82.55,24.89 82.55,22.61 86.36,22.61 86.36,24.89
  pour Top (no thermals): 75.44,21.84 75.44,19.81 70.87,19.81 70.87,17.78 77.98,17.78 77.98,20.32 84.07,20.32 84.07,24.89 82.55,24.89 82.55,21.84
1V9  (via drill 0.3, 0.79 pad 1.68)
  Top 0.254: C26.1 89.47,41.56 R31.2 89.62,40.68 v89.92,40.39
  Bottom 0.762: U6.4 89.62,45.71 R29.2 R31.2
  other vias: 90.68,41.91 90.68,41.15 89.15,40.39 90.68,40.39 89.15,39.62 89.92,39.62 90.68,39.62 20.83,51.56 20.07,51.56 21.59,51.56 17.25,51.56 18.03,51.56 16.46,51.56 8.89,53.34
  pour Power (isolate 0.203, no thermals): 0.25,63.25 0.25,50.8 72.39,50.8 72.39,53.34 86.11,53.34 86.11,39.37 92.46,39.37 92.46,48.01 114.05,48.01 114.05,63.25
  pour Bottom (no thermals): 88.9,39.37 88.9,40.77 89.28,40.77 89.28,43.31 90.81,43.31 90.81,39.37
  pour Top (no thermals): 89.15,42.42 90.81,42.42 90.81,39.5 89.15,39.5
  pour Bottom (no thermals): 19.94,50.67 19.94,51.69 21.72,51.69 21.72,50.67
  pour Bottom (no thermals): 16.38,50.67 16.38,51.69 18.16,51.69 18.16,50.67
1V9A  (via drill 0.3, 0.79 pad 1.68)
  Top 0.203: v16.64,38.61 16.82,38.43 C47.P$2 17.74,38.52 U1.P$5 | v16.64,39.88 16.76,39.88 16.89,40.01 17.6,40.01 C44.P$1 17.7,40.02 U1.P$2 | v22.35,45.97 22.35,45.85 22.23,45.72 22.23,45.14 C75.P$1 22.17,43.42 U1.P$128 | v22.48,19.43 22.17,19.74 C73.P$2 22.17,22.11 U1.P$33 | v16.64,28.45 17.47,28.45 C67.P$1 17.77,28.52 U1.P$25 | v16.64,26.92 17.47,26.92 C70.P$1 18.11,27.11 18.16,27.05 19.34,27.05 U1.P$28 | U1.P$13 20.73,34.52 v20.83,34.42 | v20.83,32.38 20.7,32.52 U1.P$17 U1.P$16 | U1.P$20 20.73,31.02 v20.83,31.11 | R3.1 18.29,19.94 v18.16,20.07 | U1.P$8 20.63,37.02 v20.83,37.21
  Bottom 0.203: R6.2 21.59,27.52 v21.59,28.45 | C54.P$1 20.65,34.6 v20.83,34.42 | C59.P$1 20.65,32.57 v20.83,32.38 | C64.P$2 20.65,30.93 v20.83,31.11 | v24.13,25.15 R5.1 | v20.83,37.21 20.57,37.21 20.32,36.96 19.87,36.96 C49.P$2 | v16.51,49.02 13.21,49.02 v12.7,49.53
  Bottom 0.61: C39.1 22.73,31.48 v22.73,31.11 v23.5,31.11 | v23.5,31.11 23.5,31.5 23.24,31.75 | v23.5,31.11 23.37,31.11 23.11,31.37
  other vias: 17.27,49.02 18.03,49.02
  pour Power (isolate 0.203, no thermals): 24.38,17.53 19.56,17.53 19.56,18.8 11.18,18.8 11.18,21.84 16,21.84 16,50.04 18.8,50.04 18.8,46.99 22.61,46.99 22.61,37.47 25.65,37.47 25.65,24.89 24.38,23.62
  pour Bottom (no thermals): 16.26,49.78 16.26,48.9 18.16,48.9 18.16,49.78
1V9D  (via drill 0.3, 0.79 pad 1.68)
  Top 0.203: v25.65,19.56 25.65,19.81 25.78,19.94 25.78,20.39 C45.P$1 25.78,20.45 25.78,22.11 U1.P$40 | v31.11,19.56 31.3,19.74 C48.P$1 31.3,21.16 31.24,21.21 31.24,22.15 U1.P$51 | v36.58,19.56 36.58,19.68 36.7,19.81 36.7,20.39 C50.P$1 36.76,21.28 36.7,21.34 36.7,22.15 U1.P$62 | U1.P$73 C55.P$1 43,29.01 v43.18,28.91 | v43.2,36.65 43.02,36.47 C60.P$1 40.62,36.47 arc-90 U1.P$88 | U1.P$99 36.76,43.4 C65.P$1 36.76,45.54 v36.58,45.72 | U1.P$110 31.24,43.39 31.24,44.2 31.3,44.25 C68.P$1 31.24,45.14 31.24,45.72 31.11,45.85 v31.11,45.97 | v25.65,45.97 25.84,45.79 C71.P$1 25.84,44.63 25.72,44.52 U1.P$121
  Bottom 0.203: L10.P$2 19.85,49.62 19.43,50.04 19.43,52.2 | 19.43,52.2 R8.2 | v8.89,49.53 10.16,50.8 14.22,50.8 15.75,52.32 19.3,52.32 19.43,52.2
  Bottom 0.254: 21.59,49.4 v21.59,48.9
  Bottom 0.61: R1.2 v25.4,39.12 | v37.72,31.11 37.72,31.5 38.09,31.87 | 38.09,31.87 C40.1 38.48,31.5 v38.48,31.11 v37.72,31.11 | v37.72,31.11 37.85,31.11 38.1,31.37 | C40.1 38.09,31.87
  other vias: 20.83,48.9 20.07,48.9
  pour Power (isolate 0.203, no thermals): 25.15,17.53 47.24,17.53 47.24,50.04 19.56,50.04 19.56,47.75 23.37,47.75 23.37,38.23 26.42,38.23 26.42,24.64 25.15,23.37
  pour Bottom (no thermals): 19.94,48.77 19.94,49.78 21.72,49.78 21.72,48.77
2V3_1V9PRE  (via drill 0.3, 0.79 pad 1.68)
  Top 0.254: v101.35,25.91 99.82,24.38 98.04,24.38 97.41,23.75 R20.2 C14.1
  other vias: 95.76,46.74 95.76,45.72 95.76,44.7 96.77,46.74 96.77,45.72 96.77,44.7 101.35,26.92 102.36,26.92 103.38,26.92 102.36,25.91 103.38,25.91 96.01,42.93
  pour Bottom (no thermals): 100.33,27.18 100.33,24.89 101.35,24.89 101.35,23.24 104.14,23.24 104.14,27.18
  pour Bottom (no thermals): 97.03,42.04 97.03,46.99 92.71,46.99 92.71,43.94 93.34,43.94 93.34,42.04
  pour Power (isolate 0.203, no thermals): 93.22,47.24 93.23,33.02 99.82,33.03 99.82,27.67 99.81,25.65 114.05,25.65 114.05,39.5 97.79,39.5 97.79,47.24
2V5  (via drill 0.3)
  Bottom 0.254: U4.3 99.92,2.07 C24.1 100.65,2.1 v101.09,2.54 | 7.11,21.59 v7.62,21.08 v6.6,21.08 7.11,21.59 | L12.P$2 7.11,21.59
  other vias: 101.85,2.54 102.62,2.54 101.09,1.52 101.85,1.52 102.62,1.52 74.17,7.87 75.18,7.87 76.2,7.87 76.2,6.6 75.18,6.6 74.17,6.6
  pour Top (no thermals): 99.31,2.67 102.87,2.67 102.87,1.14 99.31,1.14
  pour Top (no thermals): 102.87,0.51 73.91,0.51 73.91,8.26 76.45,8.26 76.45,4.57 97.28,4.57 97.28,2.79 102.87,2.79
  pour Power (isolate 0.203): 76.96,8.38 76.96,5.33 7.37,5.33 7.37,10.92 6.35,10.92 6.35,21.84 10.41,21.84 10.41,8.38
  pour Bottom (no thermals): 6.35,21.84 6.35,20.83 7.87,20.83 7.87,21.84
  pour Bottom (no thermals): 99.31,2.67 102.87,2.67 102.87,1.27 99.31,1.27
2V5A  (via drill 0.3)
  Top 0.203: 9.4,30.94 C87.P$1 v8.89,30.99 | 9.4,28.96 9.4,28.77 Y1.P$6 9.65,27.43 10.67,26.42 11.43,26.42 12.19,25.65 Y1.P$2
  Top 0.254: 9.4,30.94 C85.1 9.4,28.96
  Bottom 0.203: C87.P$1 v8.89,30.99
  Bottom 0.254: 7.11,23.11 v6.6,23.62 | L12.P$1 7.11,23.11 | 7.11,23.11 v7.62,23.62
  pour Power (isolate 0.203): 6.35,22.61 6.35,31.5 15.24,31.5 15.24,22.61
  pour Bottom (no thermals): 6.35,22.73 6.35,23.88 7.87,23.88 7.87,22.73
2V8_2V5PRE  (via drill 0.3)
  Top 0.203: v101.09,9.4 99.69,10.79 97.66,10.79 97.41,11.05 R16.2 C10.1 96.65,11.05 v96.9,10.79 | v95,21.84 95.38,22.23 95.38,24.89 95,25.27 v95.12,25.27 | v87.63,23.88 87.63,22.61 84.58,19.56 83.06,19.56 81.92,18.41 81.92,15.62 83.57,13.97 83.57,9.4 84.71,8.26 89.28,8.26 89.66,7.87 v89.79,7.87 | v89.79,5.21 89.92,5.08 96.01,5.08 96.9,5.97 v96.9,8
  Top 0.254: R11.1 v93.98,22.86
  Bottom 0.203: L3.P$2 101.17,9.32 v101.09,9.4 | v95.12,25.27 89.03,25.27 v87.63,23.88 | v89.79,7.87 v89.79,5.21 | v96.9,8 v96.9,10.79
  Bottom 0.254: v93.98,22.86 v95,21.84
  pour Bottom (no thermals): 99.19,5.84 103.89,5.84 103.89,10.16 100.84,10.16 100.84,7.37 99.19,7.37
3V3  (via drill 0.3, 0.79 pad 1.68)
  Top 0.203: v78.87,32.77 C94.1 79.32,32.83 Y2.P$3 | v77.6,49.66 C104.P$1 | U2.P$69 73.27,41.03 v73.15,41.15 | 88.34,34.55 C96.P$1 | U2.P$36 72.76,22.09 72.52,21.84 72.52,21.22 C61.P$1 | U12.7 14.31,17.91 C93.1 16.59,17.91 | 16.59,17.91 C90.P$1 | 16.59,17.91 16.59,17.58 v16.76,17.4 | R9.2 78.61,25.53 v78.36,25.27 | v21.84,11.68 21.84,12.19 22.02,12.37 C84.P$1 22.02,14.23 U10.P$8 | C91.P$1 12.5,9.47 12.45,9.53 | 12.45,9.53 C95.1 | 12.45,9.53 11.81,9.53 v11.68,9.65 | R25.2 R23.2 89.92,33.02 v90.17,33.53 | v104.78,52.83 101.09,52.83 X3.P$7
  Top 0.254: C29.1 R35.2 v90.55,11.05 | Y2.P$6 79.32,37.03 v79.25,36.96 | v64.77,42.93 64.26,43.43 U2.P$90 | U2.P$129 54.76,32.53 v55.12,32.89 | R59.2 R55.2 84.45,41.66 v84.45,41.15 | U2.P$20 64.76,23.98 C57.P$1 65.03,24.88 v65.02,24.89 | U2.P$53 73.67,33.03 v73.15,32.51 72.64,32.51 v72.39,32.26 | U2.P$42 73.69,27.53 v72.64,28.07 | v72.52,20.57 72.52,21.2 C61.P$1 | v88.39,34.04 88.34,34.09 88.34,34.55 C97.1 87.37,34.54 Y3.P$4 Y3.P$1 | R41.2 17.53,11.81 17.91,12.19 v18.16,12.19 18.41,12.19 18.67,11.94 R44.2 | U11.P$2 12.19,10.67 C95.1
  Top 0.305: Y2.P$3 Y2.P$2 | U2.P$63 73.35,38.03 v73.15,38.23 | R38.1 107.19,23.11 v107.19,27.81
  Top 0.381: X4.2 84.6,54.12 v84.58,52.2
  Top 0.508: R53.2 v82.68,41.91
  Bottom 0.203: v77.6,49.66 C104.P$1 | C43.P$1 73.41,38.48 | C76.P$1 73.41,32.77 v73.15,32.51 | C37.P$1 72.9,27.81 v72.64,28.07 | R48.1 104.27,50.42 | R45.1 104.27,52.07 | v104.78,52.83 104.52,52.83 104.27,52.58 | 11.94,9.4 v11.68,9.65
  Bottom 0.254: L8.P$2 90.04,8.63 90.55,9.14 v90.55,11.05 | v64.77,42.93 C69.P$1 C72.P$1 | C53.P$1 C74.P$1 54.86,32.64 v55.12,32.89 | C57.P$1 65.03,24.88 v65.02,24.89 | v72.39,32.26 72.39,32.52 C66.P$1 72.64,32.77 72.9,33.02 73.15,33.02 | C35.P$1 71.63,28.19 | 71.63,28.19 v71.75,28.32 | v72.64,28.07 71.75,28.07 71.63,28.19 | C89.P$1 12.2,9.66 11.94,9.4 11.94,8.52 C88.1
  Bottom 0.305: 73.41,38.48 v73.15,38.23 | 95.25,36.32 95.25,39.37 98.04,42.16 98.04,47.75 99.06,48.77 103.25,48.77 104.27,49.78 104.27,50.42 104.27,52.07 104.27,52.58 104.27,53.47 R49.1 | v91.44,36.32 95.25,36.32 | 95.25,36.32 106.93,36.32 108.46,34.8 108.46,28.45 107.82,27.81 v107.19,27.81
  other vias: 85.09,7.11 86.11,7.11 84.07,7.11 84.33,5.84
  pour Bottom (no thermals): 82.55,9.91 87.63,9.91 87.63,7.87 86.61,7.87 86.61,4.83 83.31,4.83 83.31,7.37 82.55,7.37
  pour Power (isolate 0.203, no thermals): 53.85,43.94 53.85,23.88 71.37,23.88 71.37,20.32 74.68,20.32 74.68,16.76 18.8,16.76 18.8,18.03 11.18,18.03 11.18,9.14 76.96,9.14 76.96,10.16 81.79,10.16 81.79,0.25 86.87,0.25 86.87,9.65 82.55,14.08 82.55,27.56 73.66,27.56 73.66,28.45 68.07,28.45 68.07,31.75 74.17,31.75 74.17,34.29 78.49,34.29 78.49,32.64 92.46,32.64 92.46,38.61 85.34,38.61 85.34,52.58 73.15,52.58 73.15,43.94
  pour Bottom (no thermals): 79.38,33.66 79.38,32.51 78.61,32.51 78.61,33.66
  pour Top (no thermals): 77.22,50.04 77.22,49.15 80.52,49.15 80.52,50.04
3V3A  (via drill 0.3)
  Bottom 0.254: 4.57,26.16 v4.06,25.65 | L11.P$2 4.57,26.16 | 4.57,26.16 v5.08,25.65
  other vias: 78.49,8.89 79.5,8.89 78.49,7.87 79.5,7.87 80.52,7.87 80.52,8.89
  pour Top (no thermals): 77.98,7.62 80.77,7.62 80.77,10.79 77.98,10.79
  pour Bottom (no thermals): 80.77,10.79 77.98,10.79 77.98,7.62 80.77,7.62
  pour Power (isolate 0.203, no thermals): 81.03,9.4 81.03,0.25 0.25,0.25 0.25,26.67 5.59,26.67 5.59,10.16 6.6,10.16 6.6,4.57 77.72,4.57 77.72,9.4
  pour Bottom (no thermals): 3.81,25.4 3.81,26.42 5.33,26.42 5.33,25.4
3V3OUT  (via drill 0.3)
  Top 0.203: C101.P$2 101.8,45.97 | 101.8,45.97 101.8,44.88 102.11,44.58 102.63,44.58 U14.9 | U14.8 102.49,45.29 101.8,45.97 | R63.1 103.63,40.77 v103.63,40.89 | R62.1 v98.81,41.4
  Top 0.254: v106.17,41.15 106.17,42.53 U14.1
  other vias: 102.62,46.23
  pour Power (isolate 0.203): 98.55,47.24 98.55,40.26 114.05,40.26 114.05,47.24
  pour Top (no thermals): 101.85,46.61 103.25,46.61 103.25,45.47 101.85,45.47
3V3S  (via drill 0.3, 0.79 pad 1.68)
  Top 0.203: v14.73,36.45 14.53,36.65 C81.P$1 13.66,36.7 13.08,36.7 12.94,36.56 U8.P$12 U8.P$11 | v14.73,34.67 14.53,34.47 C82.P$1 12.52,34.47 12.31,34.68 U8.P$9
  Bottom 0.203: v14.99,44.45 14.99,44.2 14.73,43.94 14.73,43.49 C80.P$1 14.73,43.38 14.73,42.8 14.62,42.69 U9.P$5 | C83.1 14.35,34.29 v14.73,34.67
  other vias: 4.06,28.32 5.08,28.32 5.08,49.53
  pour Bottom (no thermals): 3.81,28.57 3.81,27.43 5.33,27.43 5.33,28.57
  pour Power (isolate 0.203): 5.59,27.43 5.59,32.26 15.24,32.26 15.24,50.04 0.25,50.04 0.25,27.43
3V6_PRE3V3  (via drill 0.3)
  Top 0.254: C11.1 R17.2 arc-90 R17.2 86.87,18.8 83.31,18.8 v82.55,18.03
  Bottom 0.254: L4.P$2 79.3,18.75 80.01,18.03 v82.55,18.03
  pour Bottom (no thermals): 80.01,22.1 78.74,22.1 78.74,13.97 80.01,13.97
5VUSB  (via drill 0.3)
  Top 0.203: U14.10 C103.P$2 100.38,43.89 100.08,44.19 C105.P$2
  Top 0.381: C105.P$2 v99.44,44.7
  Top 0.508: L13.P$2 v108.2,40.13
  Bottom 0.508: v108.2,40.13 101.22,40.13 100.08,41.02 100.08,43.94 v99.44,44.7
5VUSB_CON
  Top 0.254: C98.1 109.75,41.4 110,41.15
  Top 0.508: J2.VCC 110,41.15 110,40.15 L13.P$1
!PB  (via drill 0.3)
  Top 0.203: v98.55,51.56 X3.P$5 | U3.P$5 105.05,17.03 v104.9,16.89
  Bottom 0.203: v98.55,51.56 102.62,51.56 103.12,52.07 103.12,53.59 104.14,54.61 108.71,54.61 109.47,53.85 109.47,28.19 106.17,24.89 106.17,18.16 v104.9,16.89
!RXLED
  Top 0.203: 99.82,40.51 99.56,40.25 D5.CATHODE
  Top 0.254: U14.11 102.16,43.24 99.82,40.89 99.82,40.51 | 99.82,40.4 D5.CATHODE
!TXLED  (via drill 0.3)
  Top 0.254: U14.5 107.11,45.29 v107.19,45.21 | v101.6,41.66 100.84,40.89 100.84,40.25 D6.CATHODE
  Bottom 0.254: v107.19,45.21 102.62,45.21 101.6,44.2 v101.6,41.66
ADC_CAL  (via drill 0.3)
  Top 0.203: v70.36,21.59 70.74,21.97 70.74,23.06 U2.P$32 | U1.P$30 19.39,26.04 20.32,26.04 20.45,26.16 21.34,26.16 21.59,25.91 21.59,24.89 21.08,24.38 20.57,24.38 20.32,24.13 19.81,24.13 19.56,23.88 v19.56,19.3 R3.2
  Bottom 0.203: v19.56,19.3 19.56,18.03 20.19,17.4 24.51,17.4 27.43,14.48 27.43,11.94 27.81,11.56 59.56,11.56 69.47,21.46 70.23,21.46 v70.36,21.59
ADC_CALDLY/DES/!SCS  (via drill 0.3)
  Top 0.203: U2.P$79 69.76,50.45 v69.98,50.67 | U1.P$127 22.72,45.2 22.99,45.47 22.99,46.48 22.73,46.86 v22.73,48.01
  Bottom 0.203: 69.98,50.8 v69.98,50.67 68.58,52.07 68.58,57.4 67.82,58.17 24.38,58.17 21.59,55.37 21.59,53.85 | v22.73,48.01 22.73,52.7 21.59,53.85 | R8.1 21.59,53.85
ADC_CALRUN  (via drill 0.3)
  Top 0.203: v71.63,20.57 71.63,20.83 71.75,20.95 U2.P$34 | v22.23,54.36 22.23,48.64 20.83,47.24 20.83,44.45 21.59,43.69 21.59,42.29 21.84,42.04 22.99,42.04 23.24,42.29 23.24,43.35 U1.P$126
  Bottom 0.203: v71.63,20.57 71.63,21.59 70.87,22.35 56.64,22.35 55.88,23.11 55.88,26.16 55.12,26.92 50.8,26.92 50.04,27.69 50.04,56.64 49.28,57.4 25.27,57.4 v22.23,54.36
ADC_CLK_N
  Top 0.127: U1.P$19 18.52,31.52 18.41,31.62 17.01,31.62 C79.2
ADC_CLK_P
  Top 0.127: U1.P$18 18.55,32.02 18.41,31.88 17.01,31.88 C78.2
ADC_DCLK_N
  Top 0.127: U1.P$81 41.4,33.02 41.53,33.15 44.76,33.15 45.27,33.66 52.2,33.66 52.32,33.53 U2.P$127
ADC_DCLK_P
  Top 0.127: U1.P$82 41.41,33.52 41.53,33.4 44.65,33.4 45.16,33.91 52.2,33.91 52.32,34.03 U2.P$126
ADC_DCLKRST  (via drill 0.3)
  Top 0.203: U1.P$15 18.05,33.52 v17.91,33.66
  Bottom 0.203: v17.91,33.66 17.91,35.18 18.41,35.81 R4.2
ADC_FSR/ECE  (via drill 0.3)
  Top 0.203: U1.P$14 20.34,34.02 20.57,33.78 21.21,33.78 21.46,34.04 21.46,36.83 v22.1,37.47
  Bottom 0.203: v22.1,37.47 R2.2 | 22.78,39.04 R1.1
  Bottom 0.61: R2.2 R1.1
ADC_OUTEDGE/DDR/SDATA  (via drill 0.3, 0.79 pad 1.68)
  Top 0.203: U2.P$75 71.76,45.72 71.37,46.1 v71.37,53.09 | v12.7,58.42 14.48,60.2 v19.3,60.2
  Top 0.254: v19.3,60.2 19.3,43.69 21.34,41.66 21.34,39.5 20.86,39.02 U1.P$4
  Bottom 0.254: v19.3,60.2 69.6,60.2 70.61,59.18 70.61,53.85 v71.37,53.09
ADC_OUTV/SCLK  (via drill 0.3, 0.79 pad 1.68)
  Top 0.203: U2.P$78 70.26,45.62 70.61,45.97 v70.61,52.07 | v16.51,58.42 17.91,58.42 v18.67,59.18
  Top 0.254: v18.67,59.18 18.67,43.31 20.7,41.27 20.7,39.88 20.34,39.52 U1.P$3
  Bottom 0.254: v70.61,52.07 69.6,53.09 69.6,58.17 68.58,59.18 v18.67,59.18
ADC_PD  (via drill 0.3)
  Top 0.203: v70.61,20.57 71.25,21.21 71.25,23.07 U2.P$33 | U1.P$26 20.75,28.02 21.08,27.69 21.34,27.69 22.61,26.42 v22.61,24.13
  Bottom 0.203: R5.2 v22.61,24.13 19.56,24.13 18.92,23.5 18.92,17.91 20.07,16.76 24.38,16.76 26.67,14.48 26.67,11.43 27.18,10.92 60.2,10.92 69.85,20.57 v70.61,20.57
ADC_PDQ  (via drill 0.3)
  Top 0.203: U2.P$143 54.49,25.53 v54.86,25.91 | v20.19,20.32 20.19,23.11 20.95,23.88 21.34,23.88 22.1,24.64 22.1,26.16 21.46,26.8 20.83,26.8 20.57,26.54 19.4,26.54 U1.P$29
  Bottom 0.203: v54.86,25.91 54.86,13.97 53.09,12.19 28.96,12.19 28.19,12.95 28.19,14.61 24.77,18.03 20.83,18.03 20.32,18.54 20.32,20.07 20.19,20.19 v20.19,20.32
ADC_PWR_EN  (via drill 0.3)
  Top 0.203: v96.65,22.86 R14.2 96.27,25.14 95.5,25.91 94.49,25.91 94.23,25.65 85.09,25.65 84.58,26.16 84.58,27.43 84.2,27.81 77.6,27.81 76.82,27.03 U2.P$41
  Bottom 0.203: U7.P$19 95.48,20.98 v96.65,22.86
ADC_REXT
  Top 0.254: U1.P$32 18.07,25.02 R7.2
ADC_TDIODE+
  Top 0.203: U1.P$34 22.72,20.71 23.11,20.32 23.11,19.18 22.61,18.67 22.1,18.67 21.84,18.41 C77.1 21.93,18.07 U10.P$1
ADC_TDIODE-
  Top 0.203: U1.P$35 23.22,23.26 23.11,23.37 21.08,23.37 20.83,23.11 20.83,19.05 21.34,18.54 C77.2 21.28,18.1 U10.P$2
ADC_VBG  (via drill 0.3)
  Top 0.203: U1.P$31 19.38,25.53 v20.7,25.53
  Bottom 0.203: v20.7,25.53 20.74,25.57 R6.1
ADC_VCMO  (via drill 0.3)
  Top 0.203: U1.P$7 18.21,37.52 v18.03,37.34
  Bottom 0.203: v18.03,37.34 18.03,38.86 17.65,39.24 15.55,39.24 U9.P$1
ADC_VCMO_BUFFER  (via drill 0.3)
  Top 0.203: U1.P$23 U1.P$22 17.99,30.02 v17.78,30.23
  Top 0.254: U8.P$10 v13.21,35.56
  Bottom 0.203: v17.78,30.23 16,32 16,36.58 15.24,37.34 13.34,37.34
  Bottom 0.254: U9.P$4 U9.P$3 13.34,40.03 13.34,37.34 13.34,35.56 v13.21,35.56
ADC_VINI+
  Top 0.254: 17.27,35.43 17.36,35.52 U1.P$11
  Top 0.279: U8.P$8 11.3,33.91 15.75,33.91 17.27,35.43
ADC_VINI-
  Top 0.254: U1.P$10 17.32,36.02 17.27,36.07
  Top 0.279: U8.P$13 11.3,37.71 11.3,37.72 15.62,37.72 17.27,36.07
ANALOG_PWR_EN  (via drill 0.3)
  Top 0.203: U2.P$40 77.08,26.53 77.6,27.05 78.23,27.05 v78.36,27.18 | v77.72,14.73 81.79,14.73 83.06,13.46 83.06,9.14 84.45,7.75 89.03,7.75 91.19,5.59 95.76,5.59 96.27,6.1 R10.2
  Top 0.254: R10.2 95.38,8.38 v95.38,9.4
  Bottom 0.203: v78.36,27.18 77.72,26.54 v77.72,14.73
  Bottom 0.254: U7.P$32 95.48,12.85 96.27,12.06 96.27,10.29 v95.38,9.4
CLK500_N
  Top 0.127: Y1.P$5 12.19,28.7 12.83,29.21 12.83,29.59 12.95,29.84 12.95,30.48 arc-90 14.61,32.13 C78.1
CLK500_P
  Top 0.127: C79.1 15.62,31.88 14.61,31.88 arc90 13.21,30.48 13.21,29.84 13.72,29.34 14.1,29.34 14.73,28.7 Y1.P$4
DI0_N
  Top 0.127: U2.P$102 58.26,45.56 58.42,45.72 58.42,48.13 arc90 58.04,48.51 arc90 57.66,48.13 57.66,47.62 arc-90 57.02,46.99 57.02,46.99 arc-90 56.38,47.62 56.38,48.13 arc90 56,48.51 55.99,48.51 arc90 55.61,48.13 55.61,47.62 arc-90 54.98,46.99 54.97,46.99 arc-90 54.34,47.62 54.34,48.13 arc90 53.95,48.51 53.95,48.51 arc90 53.57,48.13 53.57,46.74 arc-90 52.93,46.1 52.92,46.1 arc-90 52.29,46.74 52.29,48.13 arc90 51.91,48.51 51.9,48.51 arc90 51.52,48.13 51.52,46.74 arc-90 50.89,46.1 50.88,46.1 arc-90 50.24,46.74 50.24,48.13 arc90 49.86,48.51 49.86,48.51 arc90 49.48,48.13 49.48,46.61 arc-90 48.84,45.97 48.83,45.97 arc-90 48.2,46.61 48.2,48.26 arc90 47.82,48.64 47.81,48.64 arc90 47.43,48.26 47.43,46.61 arc-90 46.8,45.97 46.79,45.97 arc-90 46.15,46.61 46.15,48.13 arc90 45.77,48.51 45.77,48.51 arc90 45.38,48.13 45.38,46.61 arc-90 44.75,45.97 44.74,45.97 arc-90 44.11,46.61 44.11,48.13 arc90 43.73,48.51 43.72,48.51 arc90 43.34,48.13 43.34,46.61 arc-90 42.7,45.97 42.7,45.97 arc-90 42.06,46.61 42.06,48.13 arc90 41.68,48.51 41.67,48.51 arc90 41.29,48.13 41.29,46.61 arc-90 40.66,45.97 40.65,45.97 arc-90 40.02,46.61 40.02,48.13 arc90 39.63,48.51 39.63,48.51 arc90 39.25,48.13 39.25,47.62 arc-90 38.61,46.99 38.6,46.99 arc-90 37.97,47.62 37.97,48.13 arc90 37.59,48.51 37.58,48.51 arc90 37.2,48.13 37.2,47.62 arc-90 36.57,46.99 36.56,46.99 arc-90 35.92,47.62 35.92,48.13 arc90 35.54,48.51 35.31,48.51 arc90 34.92,48.13 34.92,44.58 35.22,44.28 U1.P$102
DI0_P
  Top 0.127: U1.P$103 34.67,43.37 34.67,48.13 arc-90 35.31,48.77 35.54,48.77 arc-90 36.18,48.13 36.18,47.62 arc90 36.56,47.24 36.57,47.24 arc90 36.95,47.62 36.95,48.13 arc-90 37.58,48.77 37.59,48.77 arc-90 38.22,48.13 38.22,47.62 arc90 38.6,47.24 38.61,47.24 arc90 38.99,47.62 38.99,48.13 arc-90 39.63,48.77 39.63,48.77 arc-90 40.27,48.13 40.27,46.61 arc90 40.65,46.23 40.66,46.23 arc90 41.04,46.61 41.04,48.13 arc-90 41.67,48.77 41.68,48.77 arc-90 42.32,48.13 42.32,46.61 arc90 42.7,46.23 42.7,46.23 arc90 43.08,46.61 43.08,48.13 arc-90 43.72,48.77 43.73,48.77 arc-90 44.36,48.13 44.36,46.61 arc90 44.74,46.23 44.75,46.23 arc90 45.13,46.61 45.13,48.13 arc-90 45.77,48.77 45.77,48.77 arc-90 46.41,48.13 46.41,46.61 arc90 46.79,46.23 46.8,46.23 arc90 47.18,46.61 47.18,48.26 arc-90 47.81,48.9 47.82,48.9 arc-90 48.45,48.26 48.45,46.61 arc90 48.83,46.23 48.84,46.23 arc90 49.22,46.61 49.22,48.13 arc-90 49.86,48.77 49.86,48.77 arc-90 50.5,48.13 50.5,46.74 arc90 50.88,46.35 50.89,46.35 arc90 51.27,46.74 51.27,48.13 arc-90 51.9,48.77 51.91,48.77 arc-90 52.54,48.13 52.54,46.74 arc90 52.92,46.35 52.93,46.35 arc90 53.31,46.74 53.31,48.13 arc-90 53.95,48.77 53.95,48.77 arc-90 54.59,48.13 54.59,47.62 arc90 54.97,47.24 54.98,47.24 arc90 55.36,47.62 55.36,48.13 arc-90 55.99,48.77 56,48.77 arc-90 56.63,48.13 56.63,47.62 arc90 57.02,47.24 57.02,47.24 arc90 57.4,47.62 57.4,48.13 arc-90 58.04,48.77 arc-90 58.67,48.13 58.67,45.47 58.76,45.38 U2.P$101
DI1_N
  Top 0.127: U1.P$100 arc-90 36.2,43.39 36.2,44.45 35.94,44.7 35.94,45.97 arc-90 36.32,46.35 37.97,46.35 arc-90 38.35,45.97 38.35,42.55 arc90 38.99,41.91 arc90 39.62,42.55 39.62,44.9 arc-90 40,45.28 40.06,45.28 arc-90 40.44,44.9 40.44,42.55 arc90 41.07,41.91 41.13,41.91 arc90 41.76,42.55 41.76,44.9 arc-90 42.14,45.28 42.2,45.28 arc-90 42.58,44.9 42.58,42.55 arc90 43.22,41.91 43.27,41.91 arc90 43.9,42.55 43.9,44.9 arc-90 44.28,45.28 44.34,45.28 arc-90 44.72,44.9 44.72,42.55 arc90 45.36,41.91 45.41,41.91 arc90 46.05,42.55 46.05,44.9 arc-90 46.43,45.28 46.48,45.28 arc-90 46.86,44.9 46.86,42.55 arc90 47.5,41.91 47.55,41.91 arc90 48.19,42.55 48.19,44.9 arc-90 48.57,45.28 48.62,45.28 arc-90 49,44.9 49,42.55 arc90 49.64,41.91 49.91,41.91 arc90 50.55,42.55 50.55,44.96 arc-90 50.93,45.34 arc-90 51.31,44.96 51.31,43.69 arc90 51.94,43.05 arc90 52.58,43.69 52.58,44.96 arc-90 52.96,45.34 arc-90 53.34,44.96 53.34,43.69 arc90 53.98,43.05 arc90 54.74,43.81 54.74,45.97 arc-90 55.12,46.35 56.64,46.35 arc-90 57.02,45.97 57.02,45.72 56.77,45.34 U2.P$105
DI1_P
  Top 0.127: U1.P$101 arc-90 35.69,43.4 35.69,45.97 arc-90 36.32,46.61 37.97,46.61 arc-90 38.61,45.97 38.61,42.55 arc90 38.99,42.16 arc90 39.37,42.55 39.37,44.9 arc-90 40,45.54 40.06,45.54 arc-90 40.69,44.9 40.69,42.55 arc90 41.07,42.16 41.13,42.16 arc90 41.51,42.55 41.51,44.9 arc-90 42.14,45.54 42.2,45.54 arc-90 42.83,44.9 42.83,42.55 arc90 43.22,42.16 43.27,42.16 arc90 43.65,42.55 43.65,44.9 arc-90 44.28,45.54 44.34,45.54 arc-90 44.98,44.9 44.98,42.55 arc90 45.36,42.16 45.41,42.16 arc90 45.79,42.55 45.79,44.9 arc-90 46.43,45.54 46.48,45.54 arc-90 47.12,44.9 47.12,42.55 arc90 47.5,42.16 47.55,42.16 arc90 47.93,42.55 47.93,44.9 arc-90 48.57,45.54 48.62,45.54 arc-90 49.26,44.9 49.26,42.55 arc90 49.64,42.16 49.91,42.16 arc90 50.29,42.55 50.29,44.96 arc-90 50.93,45.59 arc-90 51.56,44.96 51.56,43.69 arc90 51.94,43.31 arc90 52.32,43.69 52.32,44.96 arc-90 52.96,45.59 arc-90 53.59,44.96 53.59,43.69 arc90 53.98,43.31 arc90 54.48,43.81 54.48,45.97 arc-90 55.12,46.61 56.64,46.61 arc-90 57.28,45.97 57.28,45.21 U2.P$104
DI2_N
  Top 0.127: U1.P$95 41.67,40.02 41.78,40.13 42.22,40.13 42.98,40.89 49.33,40.89 49.58,41.15 52.07,41.15 52.19,41.03 U2.P$112
DI2_P
  Top 0.127: U1.P$96 41.65,40.52 41.78,40.39 42.11,40.39 42.87,41.15 49.22,41.15 49.48,41.4 52.07,41.4 52.2,41.53 U2.P$111
DI3_N
  Top 0.127: U1.P$93 41.56,39.02 41.66,39.12 42.34,39.12 42.98,39.75 52.07,39.75 52.29,39.53 U2.P$115
DI3_P
  Top 0.127: U1.P$94 41.51,39.52 41.66,39.37 42.24,39.37 42.87,40.01 52.07,40.01 52.1,40.03 U2.P$114
DI4_N
  Top 0.127: U1.P$91 41.57,38.02 41.66,38.1 42.6,38.1 43.23,38.73 52.2,38.73 52.4,38.53 U2.P$117
DI4_P
  Top 0.127: U1.P$92 41.49,38.52 41.66,38.35 42.49,38.35 43.13,38.99 52.2,38.99 52.24,39.03 U2.P$116
DI5_N
  Top 0.127: U1.P$89 41.72,37.02 41.78,37.08 42.85,37.08 43.49,37.72 52.2,37.72 52.38,37.53 U2.P$119
DI5_P
  Top 0.127: U1.P$90 41.6,37.52 41.78,37.34 42.75,37.34 43.38,37.97 52.2,37.97 52.26,38.03 U2.P$118
DI6_N
  Top 0.127: U1.P$85 41.62,35.02 41.66,35.05 43.87,35.05 45.52,36.7 52.2,36.7 52.37,36.53 U2.P$121
DI6_P
  Top 0.127: U1.P$86 41.45,35.52 41.66,35.31 43.76,35.31 45.41,36.96 52.2,36.96 52.27,37.03 U2.P$120
DI7_N
  Top 0.127: U1.P$83 41.51,34.02 41.66,34.16 44.38,34.16 45.27,35.05 52.2,35.05 52.22,35.03 U2.P$124
DI7_P
  Top 0.127: U1.P$84 41.56,34.52 41.66,34.42 44.27,34.42 45.16,35.31 52.2,35.31 52.42,35.53 U2.P$123
DID0_N
  Top 0.127: U2.P$81 68.76,45.52 68.96,45.72 68.96,59.69 arc90 68.58,60.07 24.38,60.07 arc90 24,59.69 24,44.7 24.22,44.48 U1.P$124
DID0_P
  Top 0.127: U2.P$80 69.26,45.3 69.22,45.34 69.22,59.69 arc90 68.58,60.33 24.38,60.33 arc90 23.75,59.69 23.75,43.39 arc-90 U1.P$125
DID1_N
  Top 0.127: U2.P$83 67.76,45.53 67.94,45.72 67.94,58.67 arc90 67.56,59.05 25.4,59.05 arc90 25.02,58.67 25.02,44.7 25.22,44.5 U1.P$122
DID1_P
  Top 0.127: U2.P$82 68.26,45.28 68.2,45.34 68.2,58.67 arc90 67.56,59.31 25.4,59.31 arc90 24.77,58.67 24.77,44.2 24.72,44.15 U1.P$123
DID2_N
  Top 0.127: U2.P$85 66.76,45.55 66.93,45.72 66.93,57.66 arc90 66.55,58.04 27.81,58.04 arc90 27.43,57.66 27.43,49.78 arc-90 26.8,49.15 26.29,49.15 arc90 25.91,48.77 25.91,47.67 arc90 26.29,47.29 26.8,47.29 arc-90 27.43,46.65 27.43,44.7 27.72,44.41 U1.P$117
DID2_P
  Top 0.127: U2.P$84 67.26,45.26 67.18,45.34 67.18,57.66 arc90 66.55,58.29 27.81,58.29 arc90 27.18,57.66 27.18,49.78 arc-90 26.8,49.4 26.29,49.4 arc90 25.65,48.77 25.65,47.67 arc90 26.29,47.03 26.8,47.03 arc-90 27.18,46.65 27.18,44.2 27.22,44.15 U1.P$118
DID3_N
  Top 0.127: U2.P$88 65.26,45.45 65.53,45.72 65.53,47.75 arc90 65.15,48.13 64.88,48.13 arc-90 64.24,48.77 64.24,48.85 arc-90 64.88,49.48 65.15,49.48 arc90 65.53,49.86 65.53,49.94 arc90 65.15,50.32 64.88,50.32 arc-90 64.24,50.96 64.24,51.04 arc-90 64.88,51.67 65.15,51.67 arc90 65.53,52.05 65.53,52.13 arc90 65.15,52.52 64.88,52.52 arc-90 64.24,53.15 64.24,53.23 arc-90 64.88,53.87 65.15,53.87 arc90 65.53,54.25 65.53,54.33 arc90 65.15,54.71 64.88,54.71 arc-90 64.24,55.34 64.24,55.42 arc-90 64.88,56.06 65.15,56.06 arc90 65.53,56.44 65.53,56.64 arc90 65.15,57.02 28.83,57.02 arc90 28.45,56.64 28.45,44.7 28.72,44.43 U1.P$115
DID3_P
  Top 0.127: U2.P$87 65.76,45.18 65.79,45.21 65.79,47.75 arc90 65.15,48.39 64.88,48.39 arc-90 64.5,48.77 64.5,48.85 arc-90 64.88,49.23 65.15,49.23 arc90 65.79,49.86 65.79,49.94 arc90 65.15,50.58 64.91,50.58 arc-90 64.53,50.96 64.53,51.04 arc-90 64.91,51.42 65.15,51.42 arc90 65.79,52.05 65.79,52.13 arc90 65.15,52.77 64.88,52.77 arc-90 64.5,53.15 64.5,53.23 arc-90 64.88,53.61 65.15,53.61 arc90 65.79,54.25 65.79,54.33 arc90 65.15,54.96 64.88,54.96 arc-90 64.5,55.34 64.5,55.42 arc-90 64.88,55.8 65.15,55.8 arc90 65.79,56.44 65.79,56.64 arc90 65.15,57.28 28.83,57.28 arc90 28.19,56.64 28.19,44.2 arc-90 28.22,44.17 U1.P$116
DID4_N